# EAGLE design multipreamp-1 (EAGLE 7.2.0)
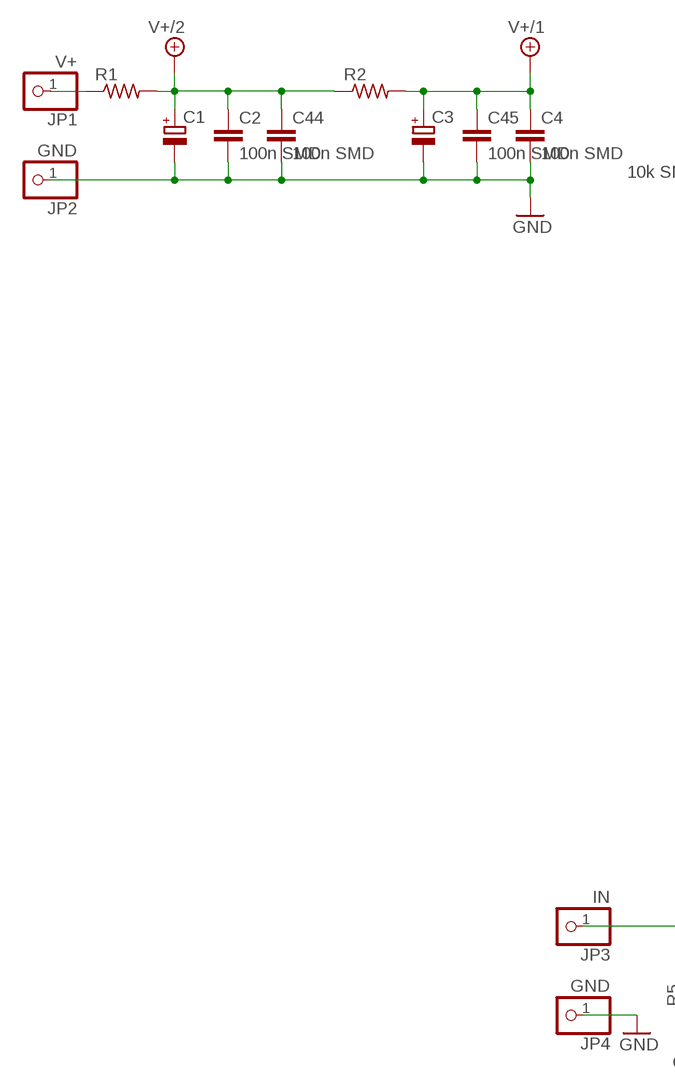
[diagram p0: schematic, sheet 1, part 1 of 2]
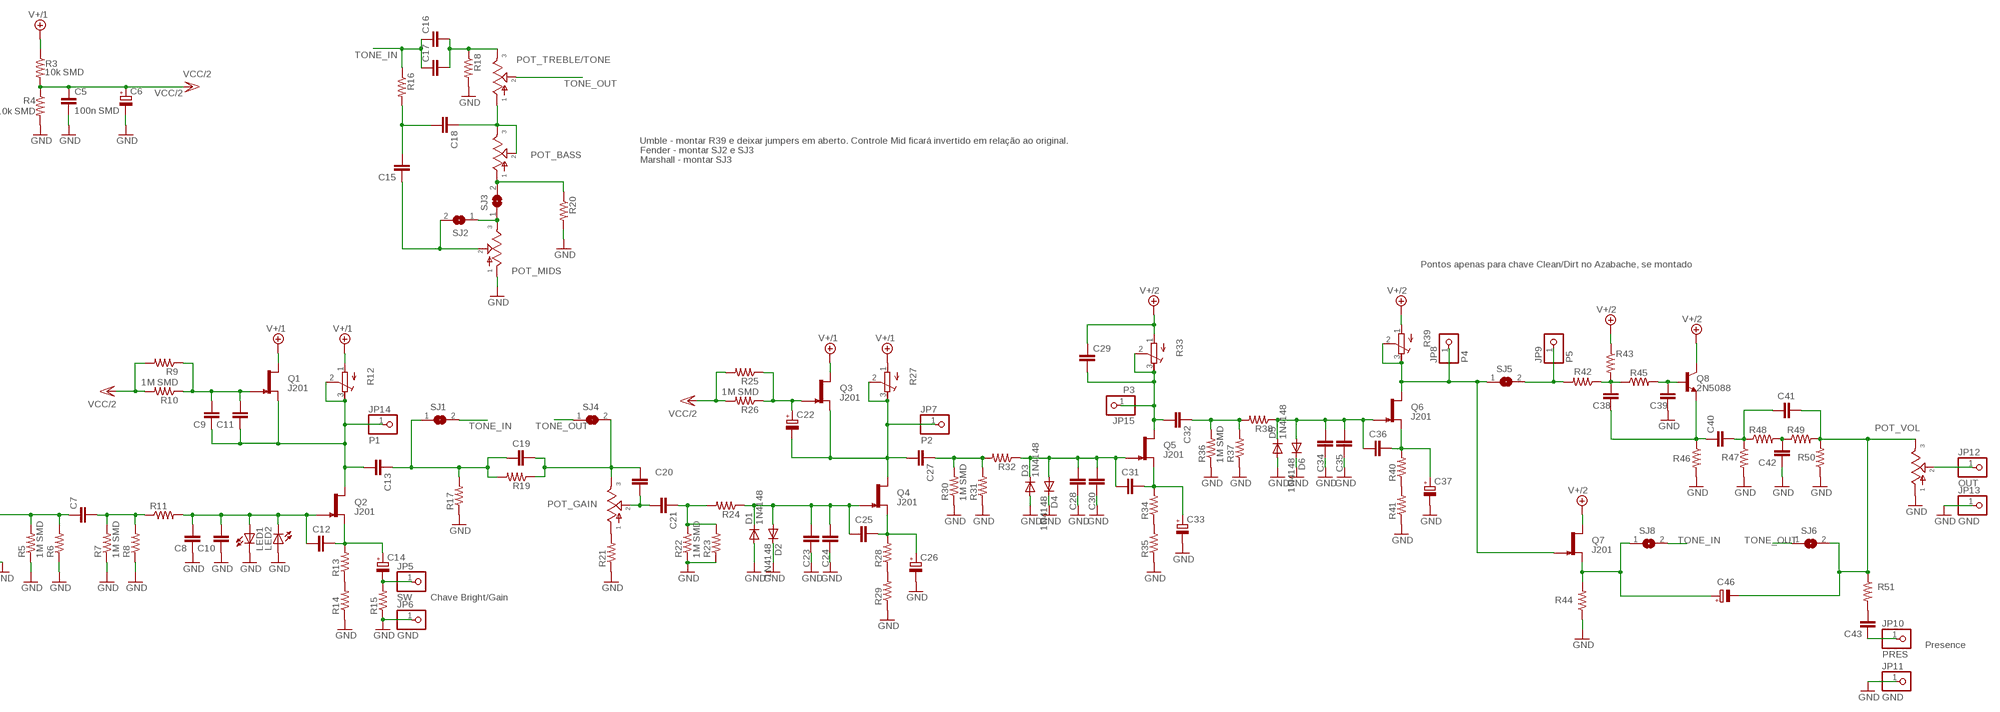
[diagram p1: schematic, sheet 1, part 2 of 2]

## Parts
C1  CPOL-EUE2.5-6  [E2,5-6]
C2  100n SMD  C-EUC0805  [C0805]
C3  CPOL-EUE2.5-6  [E2,5-6]
C4  100n SMD  C-EUC0805  [C0805]
C5  100n SMD  C-EUC0805  [C0805]
C6  CPOL-EUE2.5-6  [E2,5-6]
C7  C-EU050-025X075  [C050-025X075]
C8  C-EU025-025X050  [C025-025X050]
C9  C-EU025-025X050  [C025-025X050]
C10  C-EU025-025X050  [C025-025X050]
C11  C-EU025-025X050  [C025-025X050]
C12  C-EU025-025X050  [C025-025X050]
C13  C-EU050-025X075  [C050-025X075]
C14  CPOL-EUE2.5-6  [E2,5-6]
C15  C-EU050-025X075  [C050-025X075]
C16  C-EU025-025X050  [C025-025X050]
C17  C-EU025-025X050  [C025-025X050]
C18  C-EU050-025X075  [C050-025X075]
C19  C-EU050-025X075  [C050-025X075]
C20  C-EU025-025X050  [C025-025X050]
C21  C-EU050-025X075  [C050-025X075]
C22  CPOL-EUE2.5-6  [E2,5-6]
C23  C-EU025-025X050  [C025-025X050]
C24  C-EU025-025X050  [C025-025X050]
C25  C-EU025-025X050  [C025-025X050]
C26  CPOL-EUE2.5-6  [E2,5-6]
C27  C-EU050-025X075  [C050-025X075]
C28  C-EU025-025X050  [C025-025X050]
C29  C-EU050-025X075  [C050-025X075]
C30  C-EU025-025X050  [C025-025X050]
C31  C-EU025-025X050  [C025-025X050]
C32  C-EU050-025X075  [C050-025X075]
C33  CPOL-EUE2.5-6  [E2,5-6]
C34  C-EU025-025X050  [C025-025X050]
C35  C-EU025-025X050  [C025-025X050]
C36  C-EU025-025X050  [C025-025X050]
C37  CPOL-EUE2.5-6  [E2,5-6]
C38  C-EU050-025X075  [C050-025X075]
C39  C-EU025-025X050  [C025-025X050]
C40  C-EU050-025X075  [C050-025X075]
C41  C-EU050-025X075  [C050-025X075]
C42  C-EU050-025X075  [C050-025X075]
C43  C-EU050-025X075  [C050-025X075]
C44  100n SMD  C-EUC0805  [C0805]
C45  100n SMD  C-EUC0805  [C0805]
C46  CPOL-EUE2.5-6  [E2,5-6]
D1  1N4148  1N4148DO35-7  [DO35-7]
D2  1N4148  1N4148DO35-7  [DO35-7]
D3  1N4148  1N4148DO35-7  [DO35-7]
D4  1N4148  1N4148DO35-7  [DO35-7]
D5  1N4148  1N4148DO35-7  [DO35-7]
D6  1N4148  1N4148DO35-7  [DO35-7]
JP1  V+  PINHD-1X1  [1X01]
JP2  GND  PINHD-1X1  [1X01]
JP3  IN  PINHD-1X1  [1X01]
JP4  GND  PINHD-1X1  [1X01]
JP5  SW  PINHD-1X1  [1X01]
JP6  GND  PINHD-1X1  [1X01]
JP7  P2  PINHD-1X1  [1X01]
JP8  P4  PINHD-1X1  [1X01]
JP9  P5  PINHD-1X1  [1X01]
JP10  PRES  PINHD-1X1  [1X01]
JP11  GND  PINHD-1X1  [1X01]
JP12  OUT  PINHD-1X1  [1X01]
JP13  GND  PINHD-1X1  [1X01]
JP14  P1  PINHD-1X1  [1X01]
JP15  P3  PINHD-1X1  [1X01]
LED1  LED3MM  [LED3MM]
LED2  LED3MM  [LED3MM]
POT_BASS  POTPCB  [16MM-PCB-MOUNT]
POT_GAIN  POTPCB  [16MM-PCB-MOUNT]
POT_MIDS  POTPCB  [16MM-PCB-MOUNT]
POT_TREBLE/TONE  POTPCB  [16MM-PCB-MOUNT]
POT_VOL  POTPCB  [16MM-PCB-MOUNT]
Q1  J201  [TO92-]
Q2  J201  [TO92-]
Q3  J201  [TO92-]
Q4  J201  [TO92-]
Q5  J201  [TO92-]
Q6  J201  [TO92-]
Q7  J201  [TO92-]
Q8  2N5088  [TO92-]
R1  R-US_0207/7  [0207/7]
R2  R-US_0207/7  [0207/7]
R3  10k SMD  R-US_R0805  [R0805]
R4  10k SMD  R-US_R0805  [R0805]
R5  1M SMD  R-US_R0805  [R0805]
R6  R-US_0207/2V  [0207/2V]
R7  1M SMD  R-US_R0805  [R0805]
R8  R-US_0207/2V  [0207/2V]
R9  R-US_0207/5V  [0207/5V]
R10  1M SMD  R-US_R0805  [R0805]
R11  R-US_0207/7  [0207/7]
R12  R-TRIMM3296W  [RTRIM3296W]
R13  R-US_0207/7  [0207/7]
R14  R-US_0207/7  [0207/7]
R15  R-US_0207/7  [0207/7]
R16  R-US_0207/7  [0207/7]
R17  R-US_0207/7  [0207/7]
R18  R-US_0207/7  [0207/7]
R19  R-US_0207/7  [0207/7]
R20  R-US_0207/7  [0207/7]
R21  R-US_R0805  [R0805]
R22  1M SMD  R-US_R0805  [R0805]
R23  R-US_0207/7  [0207/7]
R24  R-US_0207/7  [0207/7]
R25  R-US_0207/5V  [0207/5V]
R26  1M SMD  R-US_R0805  [R0805]
R27  R-TRIMM3296W  [RTRIM3296W]
R28  R-US_0207/7  [0207/7]
R29  R-US_0207/7  [0207/7]
R30  1M SMD  R-US_R0805  [R0805]
R31  R-US_0207/7  [0207/7]
R32  R-US_0207/7  [0207/7]
R33  R-TRIMM3296W  [RTRIM3296W]
R34  R-US_0207/7  [0207/7]
R35  R-US_0207/7  [0207/7]
R36  1M SMD  R-US_R0805  [R0805]
R37  R-US_0207/7  [0207/7]
R38  R-US_0207/7  [0207/7]
R39  R-TRIMM3296W  [RTRIM3296W]
R40  R-US_0207/7  [0207/7]
R41  R-US_0207/7  [0207/7]
R42  R-US_0207/7  [0207/7]
R43  R-US_0207/7  [0207/7]
R44  R-US_0207/7  [0207/7]
R45  R-US_0207/7  [0207/7]
R46  R-US_0207/7  [0207/7]
R47  R-US_0207/7  [0207/7]
R48  R-US_0207/7  [0207/7]
R49  R-US_0207/7  [0207/7]
R50  R-US_0207/7  [0207/7]
R51  R-US_0207/7  [0207/7]
SJ1  SJ  [SJ]
SJ2  SJ  [SJ]
SJ3  SJ  [SJ]
SJ4  SJ  [SJ]
SJ5  SJ  [SJ]
SJ6  SJ  [SJ]
SJ8  SJ  [SJ]

## Nets
GND: C1.- C2.2 C3.- C4.2 C5.2 C6.- C8.1 C10.1 C23.1 C24.1 C26.- C28.1 C30.1 C33.- C34.1 C35.1 C37.- C39.1 C42.1 C44.2 C45.2 D1.A D2.C D3.A D4.C D5.A D6.C JP2.1 JP4.1 JP6.1 JP11.1 JP13.1 LED1.K(C) LED2.A POT_MIDS.1 POT_VOL.1 R4.2 R5.1 R6.1 R7.1 R8.1 R14.1 R15.1 R17.1 R18.2 R20.2 R21.1 R22.1 R23.1 R29.1 R30.1 R31.1 R35.1 R36.1 R37.1 R41.1 R44.1 R46.2 R47.2 R50.1
N$1: C14.- JP5.1 R15.2
N$2: C12.1 C14.+ Q2.2(S) R13.2
N$3: C20.1 C21.2 POT_GAIN.2
N$4: C8.2 C10.2 C12.2 LED1.A LED2.K(C) Q2.1(G) R11.2
N$5: C7.2 R7.2 R8.2 R11.1
N$6: C15.1 POT_MIDS.2 SJ2.2
N$7: C9.2 C11.2 Q1.1(G) R9.1 R10.1
N$8: C9.1 C11.1 C13.2 JP14.1 Q1.2(S) Q2.3(D) R12.2(S) R12.3(E)
N$9: C41.2 C46.- POT_VOL.3 R49.2 R50.2 R51.1 SJ6.2
N$10: C43.2 R51.2
N$11: C19.1 C20.2 POT_GAIN.3 R19.1 SJ4.2
N$12: POT_GAIN.1 R21.2
N$13: C21.1 R22.2 R23.2 R24.2
N$14: C43.1 JP10.1
N$15: C22.- C27.2 JP7.1 Q3.2(S) Q4.3(D) R27.2(S) R27.3(E)
N$16: C25.1 C26.+ Q4.2(S) R28.2
N$17: R28.1 R29.2
N$18: C27.1 R30.2 R31.2 R32.2
N$19: C28.2 C30.2 C31.2 D3.C D4.A Q5.1(G) R32.1
N$20: C31.1 C33.+ Q5.2(S) R34.2
N$21: R34.1 R35.2
N$22: C29.2 C32.2 JP15.1 Q5.3(D) R33.2(S) R33.3(E)
N$23: C38.1 R42.1 R43.2 R45.1
N$24: C32.1 R36.2 R37.2 R38.2
N$25: C34.2 C35.2 C36.2 D5.C D6.A Q6.1(G) R38.1
N$26: C36.1 C37.+ Q6.2(S) R40.2
N$27: R40.1 R41.2
N$28: JP8.1 Q6.3(D) Q7.1(G) R39.2(S) R39.3(E) SJ5.1
N$29: JP9.1 R42.2 SJ5.2
N$30: C39.2 Q8.2(B) R45.2
N$31: C38.2 C40.1 Q8.3(E) R46.1
N$32: C40.2 C41.1 R47.1 R48.1
N$33: C42.2 R48.2 R49.1
N$34: R13.1 R14.2
N$35: JP12.1 POT_VOL.2
N$36: C15.2 C18.2 R16.2
N$37: POT_MIDS.3 SJ2.1 SJ3.1
N$38: C7.1 JP3.1 R5.2 R6.2
N$39: C13.1 C19.2 R17.2 R19.2 SJ1.1
N$40: C22.+ Q3.1(G) R25.1 R26.1
N$42: C23.2 C24.2 C25.2 D1.C D2.A Q4.1(G) R24.1
N$43: POT_BASS.1 R20.1 SJ3.2
N$44: JP1.1 R1.1
N$45: C46.+ Q7.2(S) R44.2 SJ8.1
TONE/TREBLE_1: C18.1 POT_BASS.2 POT_BASS.3 POT_TREBLE/TONE.1
TONE/TREBLE_3: C16.2 C17.2 POT_TREBLE/TONE.3 R18.1
TONE_IN: C16.1 C17.1 R16.1 SJ1.2 SJ8.2
TONE_OUT: POT_TREBLE/TONE.2 SJ4.1 SJ6.1
V+/1: C3.+ C4.1 C45.1 Q1.3(D) Q3.3(D) R2.2 R3.1 R12.1(A) R27.1(A)
V+/2: C1.+ C2.1 C29.1 C44.1 Q7.3(D) Q8.1(C) R1.2 R2.1 R33.1(A) R39.1(A) R43.1
VCC/2: C5.1 C6.+ R3.2 R4.1 R9.2 R10.2 R25.2 R26.2

## Notes on the sheet
- Umble - montar R39 e deixar jumpers em aberto. Controle Mid ficará invertido em relação ao original.
- Fender - montar SJ2 e SJ3
- Marshall - montar SJ3
- Pontos apenas para chave Clean/Dirt no Azabache, se montado
- Chave Bright/Gain
- Presence

## Library data of the parts
C1 C3 C6 C14 C22 C26 C33 C37 C46 = rcl:CPOL-EU: POLARIZED CAPACITOR, European symbol
C2 C4 C5 C7-C13 C15-C21 C23-C25 C27-C32 C34-C36 C38-C45 = rcl:C-EU: CAPACITOR, European symbol
D1-D6 = diode:1N4148: DIODE high speed (Philips)
JP1-JP15 = pinhead:PINHD-1X1: PIN HEADER
LED1 LED2 = led:LED: LED OSRAM: - CHIPLED LG R971, LG N971, LY N971, LG Q971, LY Q971, LO R971, LY R971 LH N974, LH R974 LS Q976, LO Q976, LY Q976 LO Q996 - Hyper CHIPLED LW Q18S LB Q993, LB Q99A, LB R99A - SideLED LS A670, LO A670, LY A670, LG A670, LP A670 LB A673, LV A673, LT A673, LW A673 LH A674 LY A675 LS A676, LA A676, LO A676, LY A676, LW A676 LS A679, LY A679, LG A679 - Hyper Micro SIDELED® LS Y876, LA Y876, LO Y876, LY Y876 LT Y87S - SmartLED LW L88C, LW L88S LB L89C, LB L89S, LG L890 LS L89K, LO L89K, LY L89K LS L896, LA L896, LO L896, LY L896 - TOPLED LS T670, LO T670, LY T670, LG T670, LP T670 LSG T670, LSP T670, LSY T670, LOP T670, LYG T670 LG T671, LOG T671, LSG T671 LB T673, LV T673, LT T673, LW T673 LH T674 LS T676, LA T676, LO T676, LY T676, LB T676, LH T676, LSB T676, LW T676 LB T67C, LV T67C, LT T67C, LS T67K, LO T67K, LY T67K, LW E67C LS E67B, LA E67B, LO E67B, LY E67B, LB E67C, LV E67C, LT E67C LW T67C LS T679, LY T679, LG T679 LS T770, LO T770, LY T770, LG T770, LP T770 LB T773, LV T773, LT T773, LW T773 LH T774 LS E675, LA E675, LY E675, LS T675 LS T776, LA T776, LO T776, LY T776, LB T776 LHGB T686 LT T68C, LB T68C - Hyper Mini TOPLED® LB M676 - Mini TOPLED Santana® LG M470 LS M47K, LO M47K, LY M47K Source: http://www.osram.convergy.de LUXEON: - LUMILED® LXK2-PW12-R00, LXK2-PW12-S00, LXK2-PW14-U00, LXK2-PW14-V00 LXK2-PM12-R00, LXK2-PM12-S00, LXK2-PM14-U00 LXK2-PE12-Q00, LXK2-PE12-R00, LXK2-PE12-S00, LXK2-PE14-T00, LXK2-PE14-U00 LXK2-PB12-K00, LXK2-PB12-L00, LXK2-PB12-M00, LXK2-PB14-N00, LXK2-PB14-P00, LXK2-PB14-Q00 LXK2-PR12-L00, LXK2-PR12-M00, LXK2-PR14-Q00, LXK2-PR14-R00 LXK2-PD12-Q00, LXK2-PD12-R00, LXK2-PD12-S00 LXK2-PH12-R00, LXK2-PH12-S00 LXK2-PL12-P00, LXK2-PL12-Q00, LXK2-PL12-R00 Source: www.luxeon.com KINGBRIGHT: KA-3528ASYC Source: www.kingbright.com
POT_BASS POT_GAIN POT_MIDS POT_TREBLE/TONE POT_VOL = PATSKO:POT: Potentiometers the arrow indicates the clockwise motion of th wiper (lug 2) fully counter clockwise there is no resistance between lugs 1 and 2 fully clockwise the resistance between lugs 1 and 2 is the value of the pot
Q1-Q7 = gm-trans:J201: N-channel JFET
Q8 = gm-trans:2N5088: NPN Transistor
R1-R11 R13-R26 R28-R32 R34-R38 R40-R51 = rcl:R-US_: RESISTOR, American symbol
R12 R27 R33 R39 = rcl:R-TRIMM: Trimm resistor
SJ1-SJ6 SJ8 = jumper:SJ: SMD solder JUMPER

## Board
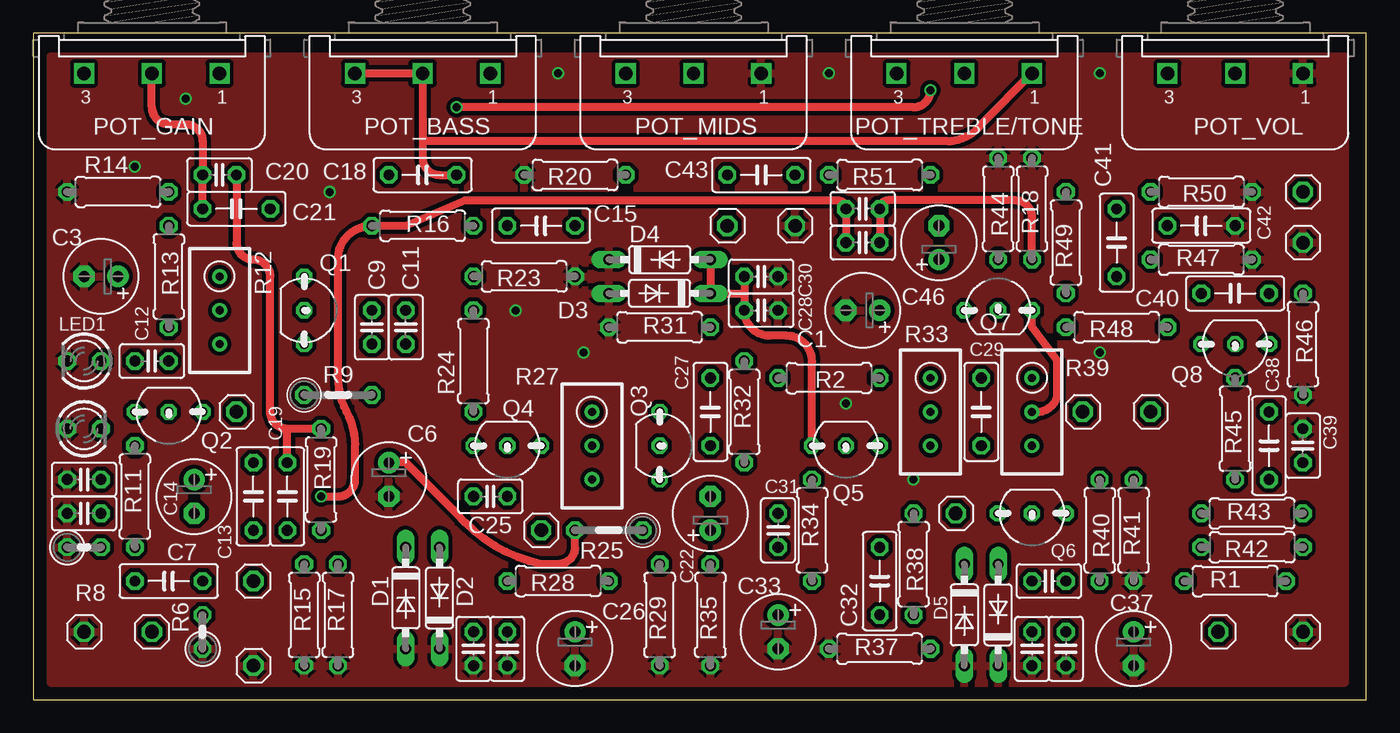
[diagram p2: board, top side]
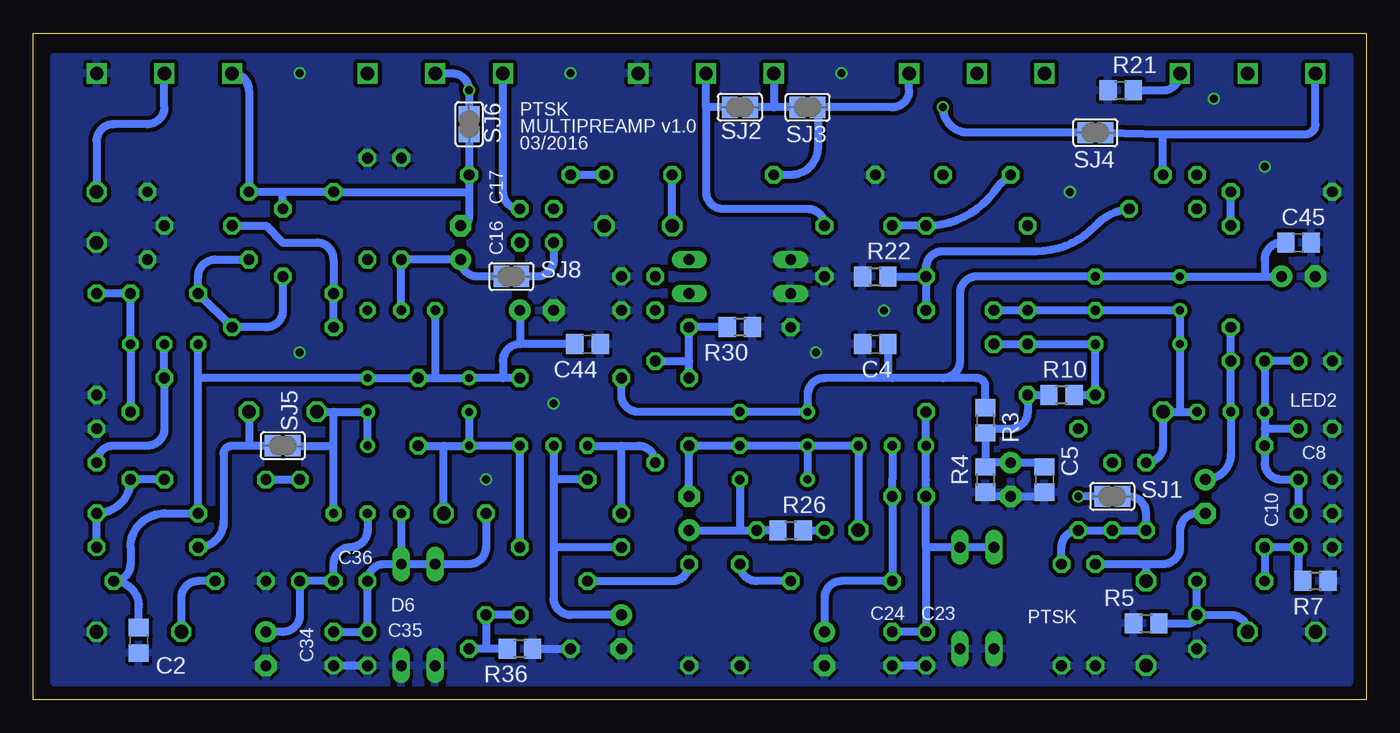
[diagram p3: board, bottom side, seen from below]

Size 100 x 50 mm. Coordinates in mm from the lower left corner, seen from the top.
Outline: 0,0 100,0 100,50 0,50 0,0
Copper layers (1*16): Top 0.035mm / dielectric 1.5mm / Bottom 0.035mm
Design rules "ShenZhen2U EagleRules": minimum track width 7mil, minimum drill 12mil, track to track 7mil, track to pad 7mil, pad to pad 7mil, via to via 7mil, smd to smd 0mil, copper to edge 20mil, drill to drill 10mil, minimum pad ring 10mil, minimum via ring 6mil, stop-mask expansion 2mil, vias tented up to drill 25mil, thermal gap 10mil

### Footprints (pad centres in the part's own frame; a part is rotated, then mirrored left to right if it is on the bottom)
E2,5-6 = drill 0.813 pad 1.6: + -1.27,0 | drill 0.813 pad 1.6 octagon: - 1.27,0
C0805 = smd 1.3 x 1.5: 1 -0.95,0; 2 0.95,0
C050-025X075 = drill 0.813 octagon: 1 -2.54,0; 2 2.54,0
C025-025X050 = drill 0.813 octagon: 1 -1.27,0; 2 1.27,0
DO35-7 = drill 0.813 long: A 3.81,0; C -3.81,0
1X01 = drill 1.016 octagon: 1 0,0
LED3MM = drill 0.813 octagon: A -1.27,0; K 1.27,0
16MM-PCB-MOUNT = drill 1 square: 1 5.08,0; 2 0,0; 3 -5.08,0
TO92- = drill 0.7 octagon: 1 2.54,0; 2 0,0; 3 -2.54,0
0207/7 = drill 0.813 octagon: 1 -3.81,0; 2 3.81,0
R0805 = smd 1.3 x 1.5: 1 -0.95,0; 2 0.95,0
0207/2V = drill 0.813 octagon: 1 -1.27,0; 2 1.27,0
0207/5V = drill 0.813 octagon: 1 -2.54,0; 2 2.54,0
RTRIM3296W = drill 0.61: 1 0,-2.54; 2 0,0; 3 0,2.54
SJ = smd 1.168 x 1.6: 1 -0.762,0; 2 0.762,0

### Placement (x,y rotation side)
C1  62.23,29.21 180 top
C2  92.08,4.45 270 bottom
C3  5.08,31.75 180 top
C4  36.83,26.67 180 bottom
C5  24.13,16.51 270 bottom
C6  26.67,16.51 270 top
C7  10.16,8.89 180 top
C8  3.81,16.51 0 top
C9  25.4,27.94 270 top
C10  3.81,13.97 0 top
C11  27.94,27.94 270 top
C12  8.89,25.4 180 top
C13  16.51,15.24 90 top
C14  12.06,15.24 270 top
C15  38.1,35.56 180 top
C16  62.23,34.29 0 top
C17  62.23,36.83 0 top
C18  29.21,39.37 180 top
C19  19.05,15.24 270 top
C20  13.97,39.37 0 top
C21  15.24,36.83 180 top
C22  50.8,13.97 90 top
C23  33.02,3.81 90 top
C24  35.56,3.81 90 top
C25  34.29,15.24 180 top
C26  40.64,3.81 270 top
C27  50.8,21.59 270 top
C28  54.61,29.21 180 top
C29  71.12,21.59 270 top
C30  54.61,31.75 180 top
C31  55.88,12.7 90 top
C32  63.5,8.89 90 top
C33  55.88,5.08 270 top
C34  77.47,3.81 90 top
C35  74.93,3.81 90 top
C36  76.2,8.89 180 top
C37  82.55,3.81 270 top
C38  92.71,19.05 90 top
C39  95.25,19.05 270 top
C40  90.17,30.48 180 top
C41  81.28,34.29 90 top
C42  87.63,35.56 180 top
C43  54.61,39.37 0 top
C44  58.42,26.67 0 bottom
C45  5.08,34.29 0 bottom
C46  67.94,34.29 90 top
D1  27.94,7.62 270 top
D2  30.48,7.62 90 top
D3  46.99,30.48 180 top
D4  46.99,33.02 0 top
D5  69.85,6.35 270 top
D6  72.39,6.35 90 top
JP1  88.9,5.08 0 top
JP2  95.25,5.08 0 top
JP3  8.89,5.08 0 top
JP4  3.81,5.08 0 top
JP5  16.51,8.89 0 top
JP6  16.51,2.54 0 top
JP7  38.1,12.7 0 top
JP8  78.74,21.59 0 top
JP9  83.82,21.59 0 top
JP10  52.07,35.56 0 top
JP11  57.15,35.56 0 top
JP12  95.25,38.1 0 top
JP13  95.25,34.29 0 top
JP14  15.24,21.59 0 top
JP15  69.22,13.97 0 top
LED1  3.81,25.4 180 top
LED2  3.81,20.32 0 top
POT_BASS  29.21,46.99 0 top
POT_GAIN  8.89,46.99 0 top
POT_MIDS  49.53,46.99 0 top
POT_TREBLE/TONE  69.85,46.99 0 top
POT_VOL  90.17,46.99 0 top
Q1  20.32,29.21 270 top
Q2  10.16,21.59 180 top
Q3  46.99,19.05 270 top
Q4  35.56,19.05 180 top
Q5  60.96,19.05 180 top
Q6  74.93,13.97 180 top
Q7  72.39,29.21 0 top
Q8  90.17,26.67 180 top
R1  90.17,8.89 0 top
R2  59.69,24.13 180 top
R3  28.57,20.95 270 bottom
R4  28.57,16.51 270 bottom
R5  16.51,5.71 0 bottom
R6  12.7,5.08 90 top
R7  3.81,8.89 180 bottom
R8  3.81,11.43 0 top
R9  22.86,22.86 0 top
R10  22.86,22.86 180 bottom
R11  7.62,15.24 90 top
R12  13.97,29.21 180 top
R13  10.16,31.75 270 top
R14  6.35,38.1 0 top
R15  20.32,6.35 90 top
R16  29.21,35.56 0 top
R17  22.86,6.35 90 top
R18  74.93,36.83 90 top
R19  21.59,16.51 270 top
R20  40.64,39.37 180 top
R21  18.41,45.72 0 bottom
R22  36.83,31.75 0 bottom
R23  36.83,31.75 180 top
R24  33.02,25.4 90 top
R25  43.18,12.7 180 top
R26  43.18,12.7 0 bottom
R27  41.91,19.05 180 top
R28  39.37,8.89 180 top
R29  46.99,6.35 90 top
R30  46.99,27.94 180 bottom
R31  46.99,27.94 0 top
R32  53.34,21.59 90 top
R33  67.31,21.59 180 top
R34  58.42,12.7 90 top
R35  50.8,6.35 90 top
R36  63.5,3.81 180 bottom
R37  63.5,3.81 0 top
R38  66.04,10.16 270 top
R39  74.93,21.59 180 top
R40  80.01,12.7 270 top
R41  82.55,12.7 90 top
R42  91.44,11.43 180 top
R43  91.44,13.97 0 top
R44  72.39,36.83 270 top
R45  90.17,20.32 90 top
R46  95.25,26.67 270 top
R47  87.63,33.02 0 top
R48  81.28,27.94 180 top
R49  77.47,34.29 90 top
R50  87.63,38.1 180 top
R51  63.5,39.37 180 top
SJ1  19.05,15.24 180 bottom
SJ2  46.99,44.45 180 bottom
SJ3  41.91,44.45 0 bottom
SJ4  20.32,42.55 0 bottom
SJ5  81.28,19.05 180 bottom
SJ6  67.31,43.18 270 bottom
SJ8  64.14,31.75 0 bottom

### Tracks (layer width: path | path; a pad name or v marks a point on that pad's centre or on a via)
GND  (via drill 0.6)
  Bottom 0.61: C23.1 C24.1 | R4.2 arc-90 28.25,15.24 C6.- 24.45,15.24 arc-90 C5.2 | R36.1 R37.1 | C35.1 C34.1
  other vias: 36.2,29.21 41.27,26.04 59.69,46.99 39.37,46.99 22.23,38.1 80.01,46.99 60.96,22.23 80.01,26.04 11.43,45.09 7.62,40.01 66.04,16.51
  pour Bottom (isolate 0.305): 1.27,48.26 1.27,1.27 98.42,1.27 98.42,48.26
  pour Top (isolate 0.305): 1.27,48.26 1.27,1.27 98.42,1.27 98.42,48.26
N$1
  Bottom 0.61: 16.51,10.16 R15.2 | JP5.1 16.51,10.16 | C14.- 12.7,13.97 arc-90 13.97,12.7 13.97,11.43 arc90 15.24,10.16 16.51,10.16
N$2
  Bottom 0.61: R13.2 C12.1 Q2.2 10.16,18.41 arc90 C14.+
N$3
  Top 0.61: C21.2 C20.1 12.7,41.91 arc90 11.43,43.18 10.16,43.18 arc-90 8.89,44.45 POT_GAIN.2
N$4
  Bottom 0.61: C10.2 C8.2 6.35,16.51 arc90 7.62,17.78 R11.2 7.62,20.32 | LED1.A C12.2 Q2.1 7.62,20.32 | LED2.K 7.62,20.32
N$5
  Bottom 0.61: C7.2 R11.1 R8.2 5.08,9.21 arc-90 R7.2
N$6
  Bottom 0.61: 49.53,44.45 49.53,38.1 arc-90 48.26,36.83 41.91,36.83 arc90 C15.1 | SJ2.2 49.53,44.45 | 49.53,44.45 POT_MIDS.2
N$7
  Bottom 0.61: R10.1 R9.1 Q1.1 C9.2 C11.2
N$8
  Bottom 0.61: 13.97,21.59 Q2.3 | C11.1 C9.1 Q1.2 R12.2 R12.3 13.97,21.59 | C13.2 arc-90 15.24,19.05 JP14.1 13.97,21.59
N$9
  Bottom 0.61: 81.28,38.1 R49.2 67.31,38.1 | 81.28,38.1 R50.2 83.82,45.72 arc-90 POT_VOL.3 | C41.2 81.28,38.1 | SJ6.2 R51.1 67.31,38.1 | 67.31,38.1 67.31,36.2 arc90 C46.-
N$10
  Bottom 0.61: C43.2 R51.2
N$11
  Top 0.61: R19.1 19.05,20.32 | 19.05,20.32 arc-90 17.78,21.59 17.78,31.75 arc90 16.51,33.02 arc-90 15.24,34.29 C20.2 | C19.1 19.05,20.32
  Bottom 0.61: SJ4.2 15.24,42.42 | 15.24,42.42 4.57,42.42 arc-90 3.81,43.18 POT_GAIN.3 | C20.2 15.24,42.42
N$12
  Bottom 0.61: R21.2 15.24,45.72 arc-90 POT_GAIN.1
N$13
  Bottom 0.61: R22.2 R23.2 R24.2 33.02,32.38 arc90 31.75,33.66 24.77,33.66 arc-46 20.32,35.56 arc40 C21.1
N$14
  Bottom 0.61: JP10.1 C43.1
N$15
  Bottom 0.61: R27.2 Q3.2 C27.2 C22.- | R27.2 R27.3 | JP7.1 Q4.3 R27.2
N$16
  Bottom 0.61: C26.+ 40.64,7.62 arc90 39.37,8.89 R28.2 C25.1 35.56,16.51 Q4.2
N$17
  Bottom 0.61: R28.1 45.72,8.89 arc90 R29.2
N$18
  Bottom 0.61: C27.1 50.8,25.4 | 50.8,25.4 R31.2 R30.2 | R32.2 50.8,25.4
N$19
  Top 0.61: C30.2 53.34,30.48 | 53.34,30.48 C28.2 arc90 55.24,27.3 56.52,27.3 arc-90 58.42,25.4 Q5.1 | D4.A D3.C 53.34,30.48
  Bottom 0.61: Q5.1 55.88,19.05 | 55.88,19.05 54.61,19.05 arc90 R32.1 | C31.2 55.88,19.05
N$20
  Bottom 0.61: Q5.2 60.96,16.51 | 60.96,16.51 60.96,11.43 | 60.96,11.43 60.96,7.62 arc-90 59.69,6.35 C33.+ | R34.2 60.96,16.51 | C31.1 60.96,11.43
N$21
  Bottom 0.61: R34.1 52.07,8.89 arc-90 R35.2
N$22
  Bottom 0.61: R33.3 Q5.3 C32.2 | R33.2 R33.3 | C29.2 69.22,19.05 | 69.22,19.05 R33.3 | JP15.1 69.22,19.05
N$23
  Bottom 0.61: R45.1 C38.1 arc90 R43.2 R42.1
N$24
  Bottom 0.61: R36.2 66.04,3.81 | 66.04,3.81 R37.2 | 66.04,3.81 R38.2 C32.1
N$25
  Bottom 0.61: R38.1 66.04,11.43 arc90 67.31,10.16 D5.C D6.A | C34.2 C35.2 C36.2 arc90 73.66,10.16 D6.A | Q6.1 D6.A
N$26
  Bottom 0.61: Q6.2 74.93,12.7 arc90 76.2,11.43 arc-90 77.47,10.16 C36.1 R40.2 80.01,6.35 arc90 81.28,5.08 C37.+
N$27
  Bottom 0.61: R41.2 R40.1
N$28
  Top 0.61: R39.2 arc90 76.83,22.86 76.83,25.4 74.93,27.94 Q7.1
  Bottom 0.61: SJ5.1 77.47,19.05 | JP8.1 77.47,21.59 | 77.47,21.59 R39.2 R39.3 | Q6.3 77.47,19.05 | 77.47,19.05 77.47,21.59
N$29
  Bottom 0.61: SJ5.2 83.82,19.05 | 83.82,19.05 85.09,19.05 arc-90 85.72,18.41 85.72,13.34 arc90 R42.2 | JP9.1 83.82,19.05
N$30
  Bottom 0.61: C39.2 arc90 93.98,19.05 91.44,19.05 arc-90 90.17,20.32 R45.2 Q8.2
N$31
  Bottom 0.61: C38.2 Q8.3 C40.1 R46.1
N$32
  Bottom 0.61: C41.1 81.28,29.21 arc90 82.55,27.94 R48.1 C40.2 87.63,31.75 arc90 86.36,33.02 R47.1
N$33
  Bottom 0.61: R48.2 R49.1 77.47,33.02 arc-90 78.74,34.29 81.28,34.29 82.55,35.56 C42.2
N$34
  Bottom 0.61: R13.1 R14.2
N$35
  Bottom 0.61: JP12.1 95.25,41.91 arc90 93.98,43.18 91.44,43.18 arc-90 90.17,44.45 POT_VOL.2
N$36
  Bottom 0.61: C15.2 R16.2 arc-53 27.94,38.1 arc16 C18.2
N$37
  Bottom 0.61: SJ3.1 44.45,44.45 | 44.45,44.45 SJ2.1 | POT_MIDS.3 44.45,44.45
N$38
  Bottom 0.61: R6.2 C7.1 | R6.2 10.16,6.35 arc90 JP3.1 | R5.2 13.34,5.71 arc-90 R6.2
N$39
  Bottom 0.61: SJ1.1 17.78,15.24 arc90 16.51,13.97 C13.1 C19.2 R19.2 arc-90 22.86,11.43 R17.2
N$40
  Bottom 0.61: Q3.1 46.99,12.7 | C22.+ 46.99,12.7 | 46.99,12.7 R25.1 R26.1
N$42
  Bottom 0.61: 33.02,11.43 D2.A D1.C | 33.02,11.43 C25.2 33.02,16.51 Q4.1 R24.1 | 33.02,11.43 C23.2 C24.2
N$43
  Bottom 0.61: R20.1 43.18,39.37 arc-90 41.15,41.4 SJ3.2 35.56,44.45 arc-90 34.29,45.72 POT_BASS.1
N$44
  Bottom 0.61: R1.1 87.63,8.89 arc-90 88.9,7.62 JP1.1
N$45
  Bottom 0.61: Q7.2 R44.2 C46.+ arc-90 66.67,31.75 SJ8.1
TONE/TREBLE_1
  Top 0.61: 29.21,41.91 68.58,41.91 arc53 71.12,43.18 POT_TREBLE/TONE.1 | C18.1 30.48,39.37 arc-90 29.21,40.64 29.21,41.91 | POT_BASS.3 POT_BASS.2 29.21,41.91
TONE/TREBLE_3
  Top 0.61: R18.1 74.93,36.2 arc90 73.66,37.47 64.14,37.47 arc90 C17.2 C16.2
  Bottom 0.61: POT_TREBLE/TONE.3 64.77,38.1 arc-90 C17.2
TONE_IN  (via drill 0.6)
  Top 0.61: v21.59,15.24 22.86,15.24 arc90 24.13,16.51 24.13,19.05 arc28 23.5,21.59 arc-28 22.86,24.13 22.86,33.02 arc-90 R16.1 27.94,35.56 32.38,37.47 60.33,37.47 arc-90 C17.1 C16.1
  Bottom 0.61: SJ1.2 v21.59,15.24 | C16.1 60.96,33.02 arc90 62.23,31.75 SJ8.2
TONE_OUT  (via drill 0.6)
  Top 0.61: v31.75,44.45 66.04,44.45 arc90 v67.31,45.72
  Bottom 0.61: SJ6.1 v67.31,45.72 arc-90 68.58,46.99 POT_TREBLE/TONE.2 | SJ4.1 29.84,42.55 arc90 v31.75,44.45
V+/1
  Bottom 0.61: 31.75,24.13 arc-90 30.48,25.4 30.48,30.48 arc90 29.21,31.75 Q1.3 R12.1 7.62,31.75 | 31.75,24.13 35.56,24.13 | 35.56,24.13 40.64,24.13 arc-90 41.91,22.86 R27.1 Q3.3 54.61,21.59 arc90 55.88,22.86 R2.2 | R3.1 28.57,23.5 arc-90 29.21,24.13 31.75,24.13 | 7.62,31.75 C3.+ | C4.1 35.88,24.45 arc-90 35.56,24.13 | C45.1 6.35,34.29 arc-90 7.62,33.02 7.62,31.75
V+/2
  Bottom 0.61: 87.63,24.13 R43.1 90.17,13.97 arc-90 92.71,11.43 92.71,10.16 arc90 R1.2 arc90 92.08,6.99 C2.1 | 87.63,24.13 Q8.1 | 87.63,24.13 R39.1 C29.1 69.85,24.13 | 69.85,24.13 R33.1 64.77,24.13 | R2.1 64.77,24.13 | 63.5,26.67 arc-90 64.77,25.4 64.77,24.13 | Q7.3 69.85,24.13 | C44.1 63.5,26.67 | C1.+ 63.5,26.67
VCC/2
  Top 0.61: C6.+ 27.94,17.78 31.75,13.97 arc37 38.1,10.16 39.37,10.16 arc90 40.64,11.43 R25.2
  Bottom 0.61: R10.2 R9.2 25.4,21.59 arc90 26.67,20.32 28.26,20.32 arc-90 R3.2 R4.1 arc90 28.25,17.78 C6.+ 24.45,17.78 arc90 C5.1 | R26.2 R25.2

### Text on the board
bNames: PTSK | MULTIPREAMP v1.0 | 03/2016 | PTSK